# Altium schematic sheet 工装板V4(2)-A.SchDoc
size A3
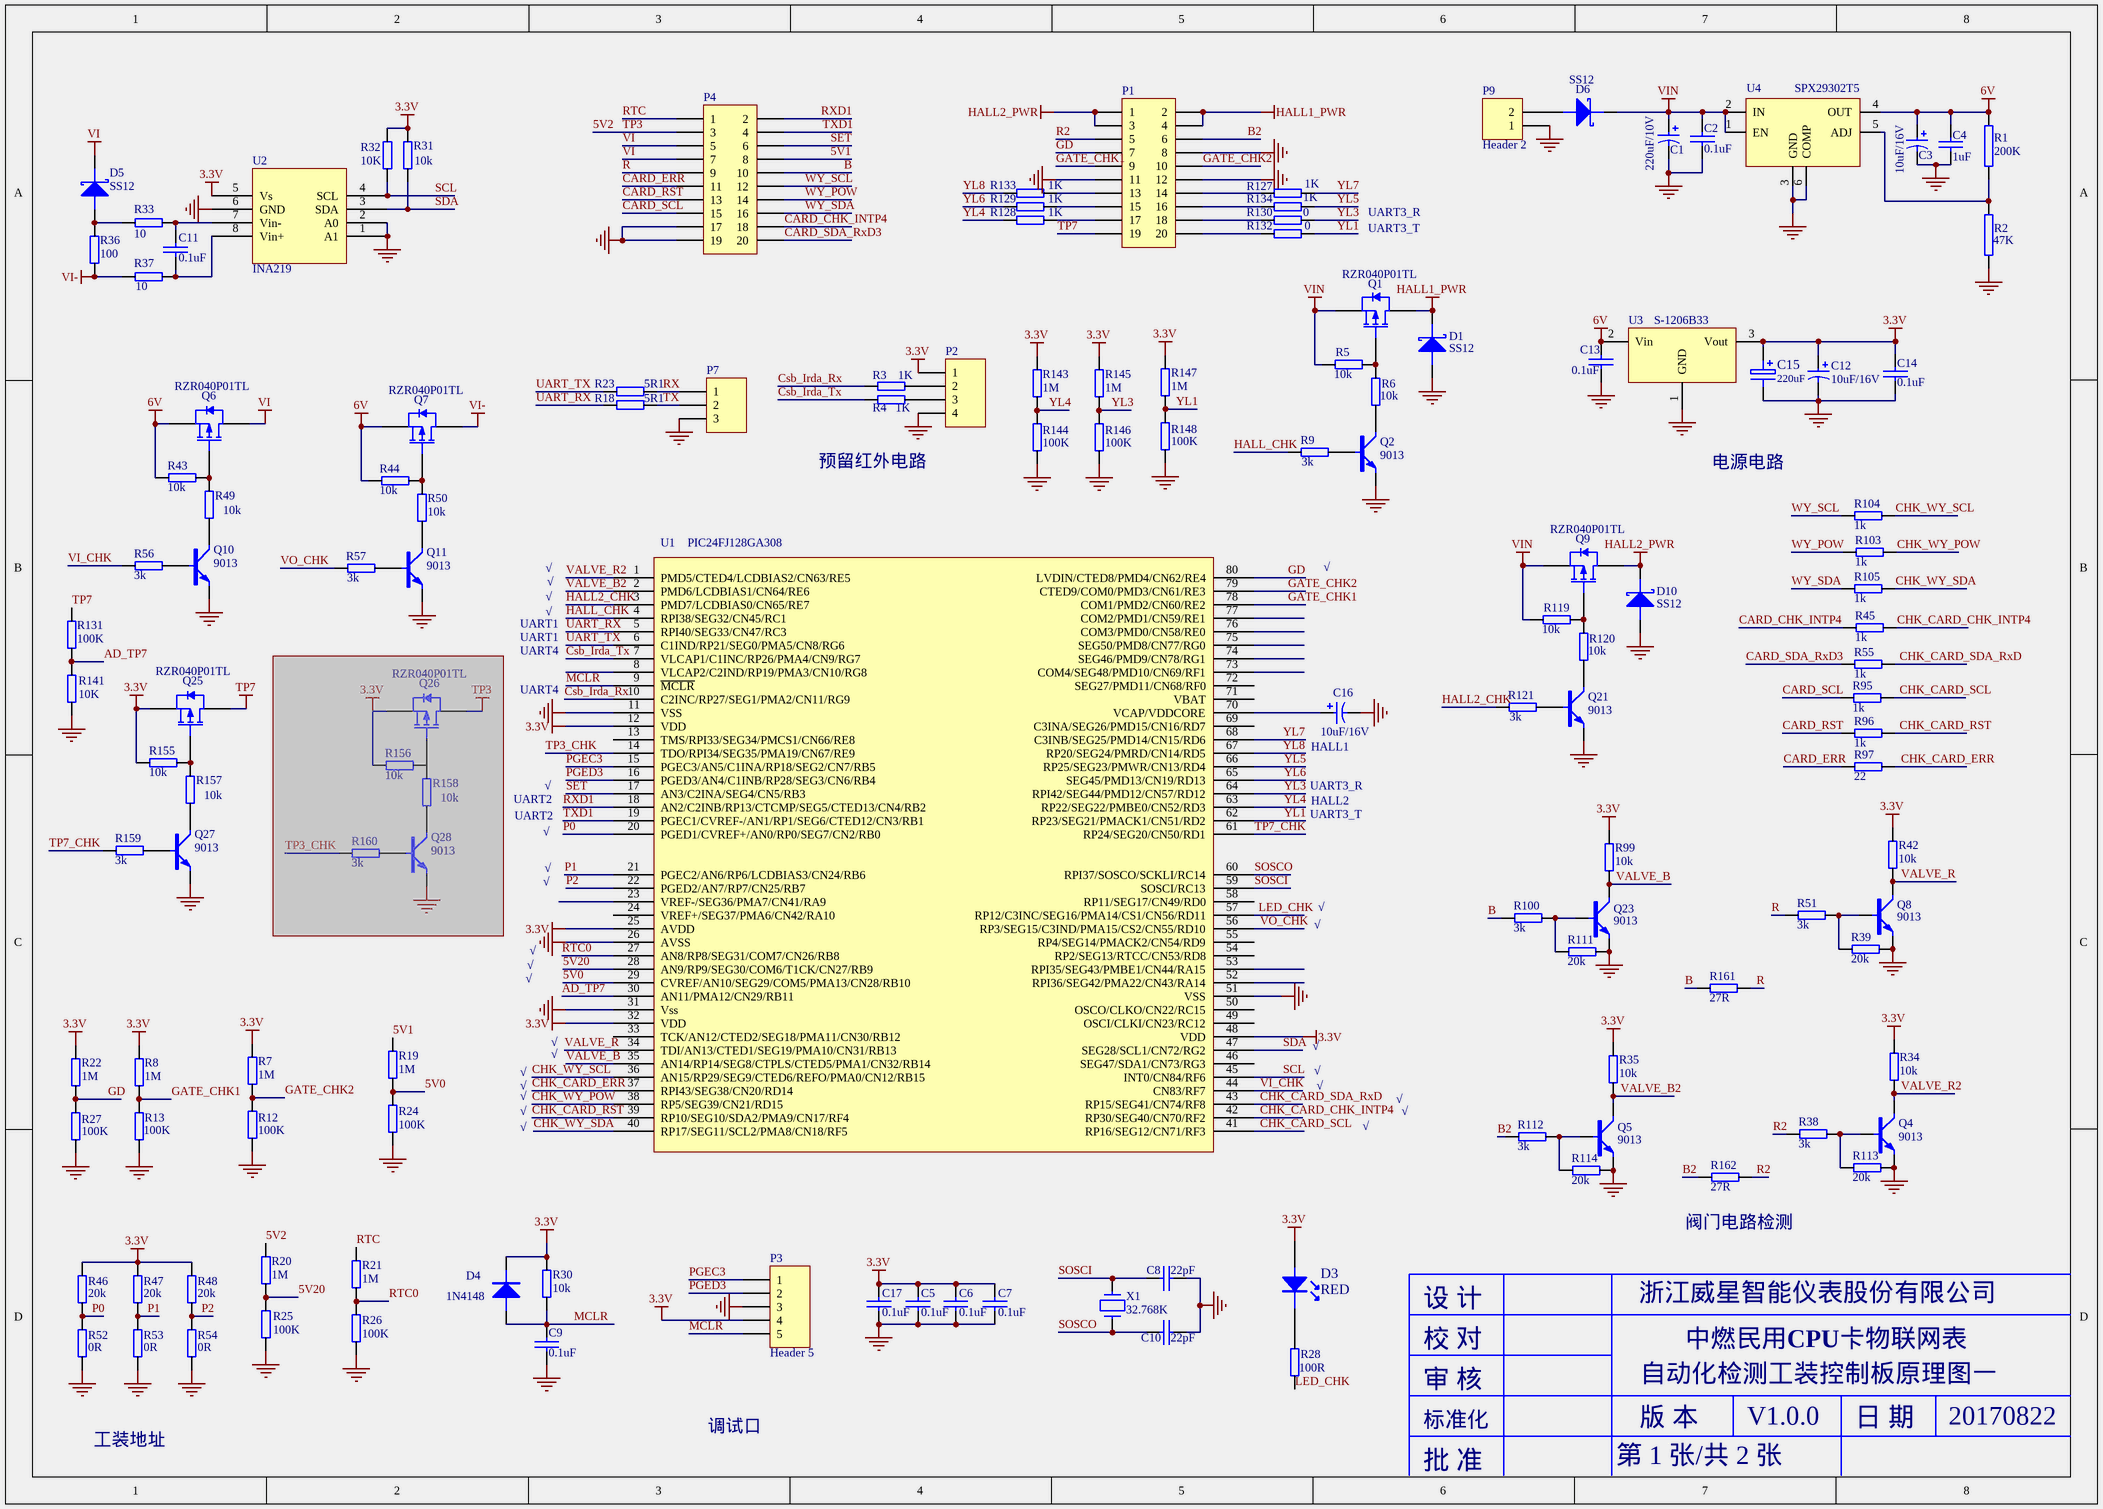
[diagram p0: 工装板V4(2)-A.SchDoc]

## Parts
C1  220uF/10V  [7343]
C2  0.1uF  [C0603]
C3  10uF/16V  [3216]
C4  1uF  [C0603]
C5  0.1uF  [C0603]
C6  0.1uF  [C0603]
C7  0.1uF  [C0603]
C8  22pF  [C0603]
C9  0.1uF  [C0603]
C10  22pF  [C0603]
C11  0.1uF  [C0603]
C12  10uF/16V  [3216]
C13  0.1uF  [C0603]
C14  0.1uF  [C0603]
C15  220uF  [7343]
C16  10uF/16V  [3216]
C17  0.1uF  [C0603]
D1  SS12  [DO-214AC]
D3  RED  [LED-3mm]
D4  1N4148  [LL34]
D5  SS12  [DO-214AC]
D6  SS12  [DO-214AC]
D10  SS12  [DO-214AC]
P1  (no value)  [PHD254_2X10P]
P2  Header 4  [HDR1X4]  (value not drawn)
P3  Header 5  [HDR1X5]
P4  (no value)  [PHD254_2X10P]
P7  Header 3  [HDR1X3]  (value not drawn)
P9  Header 2  [XH-2-2.0-V-S]
Q1  RZR040P01TL  [SOT-23-MOS]
Q2  9013  [SOT-23-TRAN]
Q4  9013  [SOT-23-TRAN]
Q5  9013  [SOT-23-TRAN]
Q6  RZR040P01TL  [SOT-23-MOS]
Q7  RZR040P01TL  [SOT-23-MOS]
Q8  9013  [SOT-23-TRAN]
Q9  RZR040P01TL  [SOT-23-MOS]
Q10  9013  [SOT-23-TRAN]
Q11  9013  [SOT-23-TRAN]
Q21  9013  [SOT-23-TRAN]
Q23  9013  [SOT-23-TRAN]
Q25  RZR040P01TL  [SOT-23-MOS]
Q26  RZR040P01TL  [SOT-23-MOS]  (masked out: inside a compile mask, not in the netlist)
Q27  9013  [SOT-23-TRAN]
Q28  9013  [SOT-23-TRAN]  (masked out: inside a compile mask, not in the netlist)
R1  200K  [R0603]
R2  47K  [R0603]
R3  1K  [R0603]
R4  1K  [R0603]
R5  10k  [R0603]
R6  10k  [R0603]
R7  1M  [R0603]
R8  1M  [R0603]
R9  3k  [R0603]
R12  100K  [R0603]
R13  100K  [R0603]
R18  5R1  [R0603]
R19  1M  [R0603]
R20  1M  [R0603]
R21  1M  [R0603]
R22  1M  [R0603]
R23  5R1  [R0603]
R24  100K  [R0603]
R25  100K  [R0603]
R26  100K  [R0603]
R27  100K  [R0603]
R28  100R  [R0603]
R30  10k  [R0603]
R31  10k  [R0603]
R32  10K  [R0603]
R33  10  [R0603]
R34  10k  [R0603]
R35  10k  [R0603]
R36  100  [R0603]
R37  10  [R0603]
R38  3k  [R0603]
R39  20k  [R0603]
R42  10k  [R0603]
R43  10k  [R0603]
R44  10k  [R0603]
R45  1k  [R0603]
R46  20k  [R0603]
R47  20k  [R0603]
R48  20k  [R0603]
R49  10k  [R0603]
R50  10k  [R0603]
R51  3k  [R0603]
R52  0R  [R0603]
R53  0R  [R0603]
R54  0R  [R0603]
R55  1k  [R0603]
R56  3k  [R0603]
R57  3k  [R0603]
R95  1k  [R0603]
R96  1k  [R0603]
R97  22  [R0603]
R99  10k  [R0603]
R100  3k  [R0603]
R103  1k  [R0603]
R104  1k  [R0603]
R105  1k  [R0603]
R111  20k  [R0603]
R112  3k  [R0603]
R113  20k  [R0603]
R114  20k  [R0603]
R119  10k  [R0603]
R120  10k  [R0603]
R121  3k  [R0603]
R127  1K  [R0603]
R128  1K  [R0603]
R129  1K  [R0603]
R130  0  [R0603]
R131  100K  [R0603]
R132  0  [R0603]
R133  1K  [R0603]
R134  1K  [R0603]
R141  10K  [R0603]
R143  1M  [R0603]
R144  100K  [R0603]
R145  1M  [R0603]
R146  100K  [R0603]
R147  1M  [R0603]
R148  100K  [R0603]
R155  10k  [R0603]
R156  10k  [R0603]  (masked out: inside a compile mask, not in the netlist)
R157  10k  [R0603]
R158  10k  [R0603]  (masked out: inside a compile mask, not in the netlist)
R159  3k  [R0603]
R160  3k  [R0603]  (masked out: inside a compile mask, not in the netlist)
R161  27R  [R1206]
R162  27R  [R1206]
U1  PIC24FJ128GA308  [LQFP-80]
U2  INA219  [SO-8]
U3  S-1206B33  [SOT-89]
U4  SPX29302T5  [TO-263]
X1  32.768K  [XTAL-2S]

## Nets
3.3V: C5.1 C6.1 C7.1 C12.1 C14.1 C15.1 C17.1 D3.1 D4.2(K) P2.1 P3.4 Q25.S R7.1 R8.1 R22.1 R30.1 R31.2 R32.2 R34.1 R35.1 R42.1 R46.1 R47.1 R48.1 R99.1 R143.1 R145.1 R147.1 R155.1 U1.12(VDD) U1.25(AVDD) U1.32(VDD) U1.48(VDD) U2.5(Vs) U3.3(Vout)
6V: C3.1 C4.2 C13.1 Q6.S Q7.S R1.1 R43.1 R44.2 U3.2(Vin) U4.4(OUT)
GND: C1.2 C2.1 C3.2 C4.1 C5.2 C6.2 C7.2 C8.2 C9.2 C10.2 C12.2 C13.2 C14.2 C15.2 C16.2 C17.2 D1.1(A) D10.1(A) P1.8 P1.11 P1.12 P2.4 P3.3 P4.17 P4.19 P7.3 P9.1 Q2.E Q4.E Q5.E Q8.E Q10.E Q11.E Q21.E Q23.E Q27.E R2.2 R12.2 R13.2 R24.2 R25.2 R26.2 R27.2 R39.1 R52.1 R53.1 R54.1 R111.2 R113.2 R114.2 R141.2 R144.2 R146.2 R148.2 U1.11(VSS) U1.26(AVSS) U1.31(Vss) U1.51(VSS) U2.1(A1) U2.2(A0) U2.6(GND) U3.1(GND) U4.3(GND) U4.6(COMP)
HALL1_PWR: D1.2(K) P1.2 P1.4 Q1.D
HALL2_PWR: D10.2(K) P1.1 P1.3 Q9.D
TP7: P1.19 Q25.D R131.1
VI: D5.2(K) P4.5 P4.7 Q6.D
VI-: Q7.D R36.2 R37.2
VIN: C1.1 C2.2 D6.2(K) Q1.S Q9.S R5.2 R119.2 U4.1(EN) U4.2(IN)
5V0: R19.2 R24.1 U1.29(CVREF/AN10/SEG29/COM5/PMA13/CN28/RB10)
5V1: P4.8 R19.1
5V2: P4.3 R20.1  [also labelled TP3]
5V20: R20.2 R25.1 U1.28(AN9/RP9/SEG30/COM6/T1CK/CN27/RB9)
AD_TP7: R131.2 R141.1 U1.30(AN11/PMA12/CN29/RB11)
B: P4.10 R100.2 R161.2
B2: P1.6 R112.2 R162.2
CARD_CHK_INTP4: P4.18 R45.2
CARD_ERR: P4.11 R97.2
CARD_RST: P4.13 R96.2
CARD_SCL: P4.15 R95.2
CARD_SDA_RxD3: P4.20 R55.2
CHK_CARD_CHK_INTP4: R45.1 U1.42(RP30/SEG40/CN70/RF2)
CHK_CARD_ERR: R97.1 U1.37(RPI43/SEG38/CN20/RD14)
CHK_CARD_RST: R96.1 U1.39(RP10/SEG10/SDA2/PMA9/CN17/RF4)
CHK_CARD_SCL: R95.1 U1.41(RP16/SEG12/CN71/RF3)
CHK_CARD_SDA_RxD: R55.1 U1.43(RP15/SEG41/CN74/RF8)
CHK_WY_POW: R103.2 U1.38(RP5/SEG39/CN21/RD15)
CHK_WY_SCL: R104.1 U1.36(AN15/RP29/SEG9/CTED6/REFO/PMA0/CN12/RB15)
CHK_WY_SDA: R105.1 U1.40(RP17/SEG11/SCL2/PMA8/CN18/RF5)
Csb_Irda_Rx: R3.2 U1.10(C2INC/RP27/SEG1/PMA2/CN11/RG9)
Csb_Irda_Tx: R4.2 U1.7(VLCAP1/C1INC/RP26/PMA4/CN9/RG7)
GATE_CHK1: P1.9 R8.2 R13.1 U1.78(COM1/PMD2/CN60/RE2)
GATE_CHK2: P1.10 R7.2 R12.1 U1.79(CTED9/COM0/PMD3/CN61/RE3)
GD: P1.7 R22.2 R27.1 U1.80(LVDIN/CTED8/PMD4/CN62/RE4)
HALL2_CHK: R121.1 U1.3(PMD7/LCDBIAS0/CN65/RE7)
HALL_CHK: R9.1 U1.4(RPI38/SEG32/CN45/RC1)
LED_CHK: R28.2 U1.57(RP12/C3INC/SEG16/PMA14/CS1/CN56/RD11)
MCLR: C9.1 D4.1(A) P3.5 R30.2 U1.9(~{MCLR})
P0: R46.2 R52.2 U1.20(PGED1/CVREF+/AN0/RP0/SEG7/CN2/RB0)
P1: R47.2 R53.2 U1.21(PGEC2/AN6/RP6/LCDBIAS3/CN24/RB6)
P2: R48.2 R54.2 U1.22(PGED2/AN7/RP7/CN25/RB7)
PGEC3: P3.1 U1.15(PGEC3/AN5/C1INA/RP18/SEG2/CN7/RB5)
PGED3: P3.2 U1.16(PGED3/AN4/C1INB/RP28/SEG3/CN6/RB4)
R: P4.9 R51.2 R161.1
R2: P1.5 R38.2 R162.1
RTC: P4.1 R21.1
RTC0: R21.2 R26.1 U1.27(AN8/RP8/SEG31/COM7/CN26/RB8)
RX: P7.1 R23.1
RXD1: P4.2 U1.18(AN2/C2INB/RP13/CTCMP/SEG5/CTED13/CN4/RB2)
SCL: R32.1 U1.45(INT0/CN84/RF6) U2.4(SCL)
SDA: R31.1 U1.47(SEG28/SCL1/CN72/RG2) U2.3(SDA)
SET: P4.6 U1.17(AN3/C2INA/SEG4/CN5/RB3)
SOSCI: C8.1 U1.59(SOSCI/RC13) X1.2
SOSCO: C10.1 U1.60(RPI37/SOSCO/SCKLI/RC14) X1.1
TP3_CHK: U1.14(TDO/RPI34/SEG35/PMA19/CN67/RE9)
TP7_CHK: R159.1 U1.61(RP24/SEG20/CN50/RD1)
TX: P7.2 R18.1
TXD1: P4.4 U1.19(PGEC1/CVREF-/AN1/RP1/SEG6/CTED12/CN3/RB1)
UART_RX: R18.2 U1.5(RPI40/SEG33/CN47/RC3)
UART_TX: R23.2 U1.6(C1IND/RP21/SEG0/PMA5/CN8/RG6)
VALVE_B: Q23.C R99.2 U1.35(AN14/RP14/SEG8/CTPLS/CTED5/PMA1/CN32/RB14)
VALVE_B2: Q5.C R35.2 U1.2(PMD6/LCDBIAS1/CN64/RE6)
VALVE_R: Q8.C R42.2 U1.34(TDI/AN13/CTED1/SEG19/PMA10/CN31/RB13)
VALVE_R2: Q4.C R34.2 U1.1(PMD5/CTED4/LCDBIAS2/CN63/RE5)
VI_CHK: R56.1 U1.44(CN83/RF7)
VO_CHK: R57.1 U1.56(RP3/SEG15/C3IND/PMA15/CS2/CN55/RD10)
WY_POW: P4.14 R103.1
WY_SCL: P4.12 R104.2
WY_SDA: P4.16 R105.2
YL1: R132.1 R147.2 R148.1 U1.62(RP23/SEG21/PMACK1/CN51/RD2)
YL3: R130.1 R145.2 R146.1 U1.64(RPI42/SEG44/PMD12/CN57/RD12)
YL4: R129.2 R143.2 R144.1 U1.63(RP22/SEG22/PMBE0/CN52/RD3)
YL5: R134.1 U1.66(RP25/SEG23/PMWR/CN13/RD4)
YL6: R128.2 U1.65(SEG45/PMD13/CN19/RD13)
YL7: R127.1 U1.68(C3INB/SEG25/PMD14/CN15/RD6)
YL8: R133.2 U1.67(RP20/SEG24/PMRD/CN14/RD5)
NetC11_1: C11.1 R33.1 U2.7(Vin-)
NetC11_2: C11.2 R37.1 U2.8(Vin+)
NetC16_1: C16.1 U1.70(VCAP/VDDCORE)
NetD3_2: D3.2 R28.1
NetD5_1: D5.1(A) R33.2 R36.1
NetD6_1: D6.1(A) P9.2
NetP1_13: P1.13 R133.1
NetP1_14: P1.14 R127.2
NetP1_15: P1.15 R128.1
NetP1_16: P1.16 R134.2
NetP1_17: P1.17 R129.1
NetP1_18: P1.18 R130.2
NetP1_20: P1.20 R132.2
NetP2_2: P2.2 R3.1
NetP2_3: P2.3 R4.1
NetQ1_G: Q1.G R5.1 R6.2
NetQ2_B: Q2.B R9.2
NetQ2_C: Q2.C R6.1
NetQ4_B: Q4.B R38.1 R113.1
NetQ5_B: Q5.B R112.1 R114.1
NetQ6_G: Q6.G R43.2 R49.2
NetQ7_G: Q7.G R44.1 R50.2
NetQ8_B: Q8.B R39.2 R51.1
NetQ9_G: Q9.G R119.1 R120.2
NetQ10_B: Q10.B R56.2
NetQ10_C: Q10.C R49.1
NetQ11_B: Q11.B R57.2
NetQ11_C: Q11.C R50.1
NetQ21_B: Q21.B R121.2
NetQ21_C: Q21.C R120.1
NetQ23_B: Q23.B R100.1 R111.1
NetQ25_G: Q25.G R155.2 R157.2
NetQ27_B: Q27.B R159.2
NetQ27_C: Q27.C R157.1
NetR1_2: R1.2 R2.1 U4.5(ADJ)

Not connected (* = marked no-connect by the designer): U1 8(VLCAP2/C2IND/RP19/PMA3/CN10/RG8) 13(TMS/RPI33/SEG34/PMCS1/CN66/RE8) 23(VREF-/SEG36/PMA7/CN41/RA9) 24(VREF+/SEG37/PMA6/CN42/RA10) 33(TCK/AN12/CTED2/SEG18/PMA11/CN30/RB12) 46(SEG47/SDA1/CN73/RG3) 49(OSCI/CLKI/CN23/RC12) 50(OSCO/CLKO/CN22/RC15) 52(RPI36/SEG42/PMA22/CN43/RA14) 53(RPI35/SEG43/PMBE1/CN44/RA15) 54(RP2/SEG13/RTCC/CN53/RD8) 55(RP4/SEG14/PMACK2/CN54/RD9) 58(RP11/SEG17/CN49/RD0) 69(C3INA/SEG26/PMD15/CN16/RD7) 71(VBAT) 72(SEG27/PMD11/CN68/RF0) 73(COM4/SEG48/PMD10/CN69/RF1) 74(SEG46/PMD9/CN78/RG1) 75(SEG50/PMD8/CN77/RG0) 76(COM3/PMD0/CN58/RE0) 77(COM2/PMD1/CN59/RE1)

## Notes on the sheet
- UART3_R
- UART3_T
- 预留红外电路
- 电源电路
- √
- UART1
- UART4
- (near C16) HALL1
- UART2
- HALL2
- (near R162) 阀门电路检测
- 设 计
- 浙江威星智能仪表股份有限公司
- 校 对
- 审 核
- 自动化检测工装控制板原理图一
- 中燃民用CPU卡物联网表
- 工装地址
- 调试口
- 标准化
- 版 本
- V1.0.0
- 日 期
- 20170822
- 批 准
- 第 1 张/共 2 张

## Library data of the parts
C1 C3 C12 C16 = CAP-POL2: 钽电容
C2 C4-C11 C13 C14 C17 = CAP: 无极性电容
C15 = CAP-POL1: 电解电容
D1 D5 D10 = D-Sotk   PASS: 肖特基二极管
D3 = LED
D4 = DIODE
D6 = D-Sotk: 肖特基二极管
P1 P4 = Header 10X2  PASS: Header, 10-Pin, Dual row
P2 = Header 4: Header, 4-Pin
P3 = Header 5: Header, 5-Pin
P7 = Header 3: Header, 3-Pin
P9 = Header 2: Header, 2-Pin
Q1 Q6 Q7 Q9 Q25 Q26 = MOS-P: P-channel  MOSFET
Q2 Q4 Q5 Q8 Q10 Q11 Q21 Q23 Q27 Q28 = NPN-S: NPN Transistor
R1 R2 = RES2
R3-R9 R12 R13 R18-R28 R30-R39 R42-R45 R49-R51 R55-R57 R95-R97 R99 R100 R103-R105 R111-R114 R119-R121 R127-R134 R141 R143-R148 R155-R162 = RES
R46-R48 R52-R54 = RES: 电阻
U1 = PIC24FJ64GA308
U2 = Component_2
U3 = VOLTRER1
U4 = SPX29302T5: Value: 1K; Published: 8-Jun-2000; LatestRevisionDate: 04-Mar-2005; LatestRevisionNote: PCB Footprint replaced.; PackageReference: J1-0603; Publisher: Altium Limited
X1 = XTAL1: 晶振,2PIN